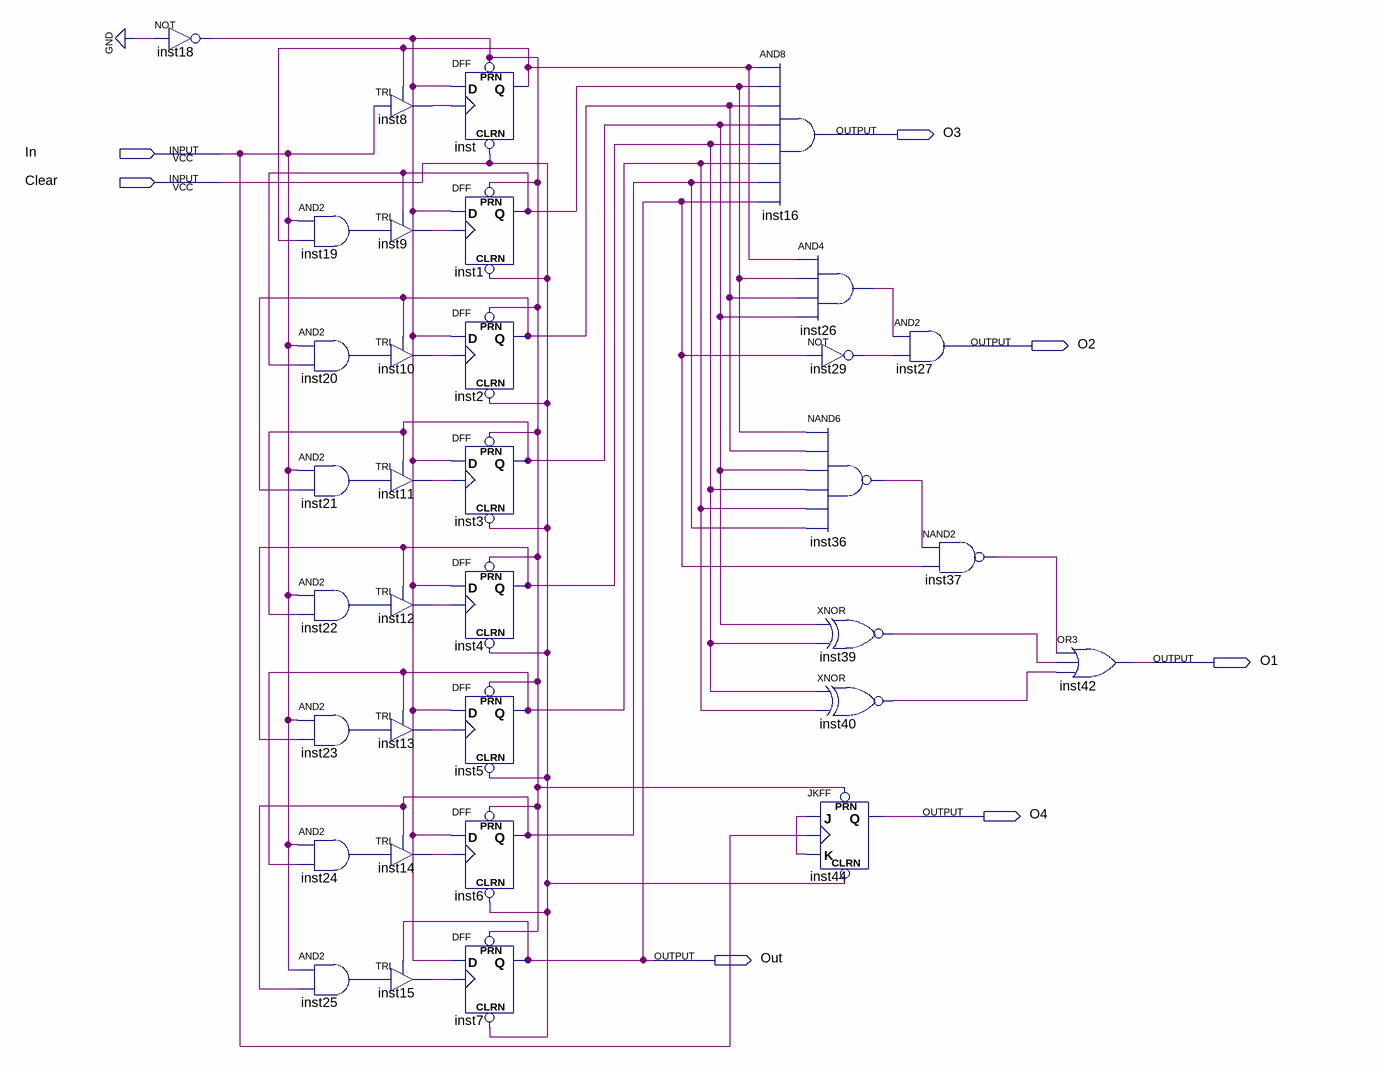
[diagram p0: schematic sheet]
// Quartus schematic Cont8.bdf as structural Verilog: 34 symbols, 7 pins
module Cont8 (
  input  In,
  input  Clear,
  output O3,
  output O2,
  output O1,
  output O4,
  output Out
);

  wire inst1_q, inst2_q, inst3_q, inst4_q, inst5_q, inst6_q, inst8_out, inst9_out, inst10_out, inst11_out,
       inst12_out, inst13_out, inst14_out, inst15_out, inst18_out, inst19_out, inst20_out, inst21_out,
       inst22_out, inst23_out, inst24_out, inst25_out, inst26_out, inst29_out, inst36_out, inst37_out,
       inst39_out, inst40_out, inst_q, undriven;

  not inst18 (inst18_out, 1'b0);
  and inst19 (inst19_out, In, inst_q);
  and inst20 (inst20_out, In, inst1_q);
  and inst21 (inst21_out, In, inst2_q);
  and inst22 (inst22_out, In, inst3_q);
  and inst23 (inst23_out, In, inst4_q);
  and inst24 (inst24_out, In, inst5_q);
  and inst25 (inst25_out, In, inst6_q);
  TRI inst8 (.IN(In), .OE(inst_q), .OUT(inst8_out));
  TRI inst9 (.IN(inst19_out), .OE(inst1_q), .OUT(inst9_out));
  TRI inst10 (.IN(inst20_out), .OE(inst2_q), .OUT(inst10_out));
  TRI inst11 (.IN(inst21_out), .OE(inst3_q), .OUT(inst11_out));
  TRI inst12 (.IN(inst22_out), .OE(inst4_q), .OUT(inst12_out));
  TRI inst13 (.IN(inst23_out), .OE(inst5_q), .OUT(inst13_out));
  TRI inst14 (.IN(inst24_out), .OE(inst6_q), .OUT(inst14_out));
  TRI inst15 (.IN(inst25_out), .OE(Out), .OUT(inst15_out));
  DFF inst (.CLRN(Clear), .CLK(inst8_out), .D(inst18_out), .PRN(inst18_out), .Q(inst_q));
  DFF inst1 (.CLRN(Clear), .CLK(inst9_out), .D(inst18_out), .PRN(inst18_out), .Q(inst1_q));
  DFF inst2 (.CLRN(Clear), .CLK(inst10_out), .D(inst18_out), .PRN(inst18_out), .Q(inst2_q));
  DFF inst3 (.CLRN(Clear), .CLK(inst11_out), .D(inst18_out), .PRN(inst18_out), .Q(inst3_q));
  DFF inst4 (.CLRN(Clear), .CLK(inst12_out), .D(inst18_out), .PRN(inst18_out), .Q(inst4_q));
  DFF inst5 (.CLRN(Clear), .CLK(inst13_out), .D(inst18_out), .PRN(inst18_out), .Q(inst5_q));
  DFF inst6 (.CLRN(Clear), .CLK(inst14_out), .D(inst18_out), .PRN(inst18_out), .Q(inst6_q));
  DFF inst7 (.CLRN(Clear), .CLK(inst15_out), .D(inst18_out), .PRN(inst18_out), .Q(Out));
  and inst16 (O3, inst_q, inst1_q, inst2_q, inst3_q, inst4_q, inst5_q, inst6_q, Out);
  and inst26 (inst26_out, inst_q, inst1_q, inst2_q, inst3_q);
  not inst29 (inst29_out, Out);
  nand inst36 (inst36_out, inst1_q, inst2_q, inst3_q, inst4_q, inst5_q, inst6_q);
  xnor inst39 (inst39_out, inst3_q, inst4_q);
  xnor inst40 (inst40_out, inst4_q, inst5_q);
  JKFF inst44 (.PRN(inst18_out), .CLRN(Clear), .K(undriven), .J(undriven), .CLK(In), .Q(O4));
  and inst27 (O2, inst26_out, inst29_out);
  nand inst37 (inst37_out, inst36_out, Out);
  or inst42 (O1, inst37_out, inst39_out, inst40_out);
endmodule
